# Altium schematic sheet StandUp.SchDoc: Moduł do monitorowania czasu siedzenia
size A4; DrawnBy: MC, JD, AP - zespół 2; DocumentNumber: 1/1; SheetNumber: 1; SheetTotal: 1
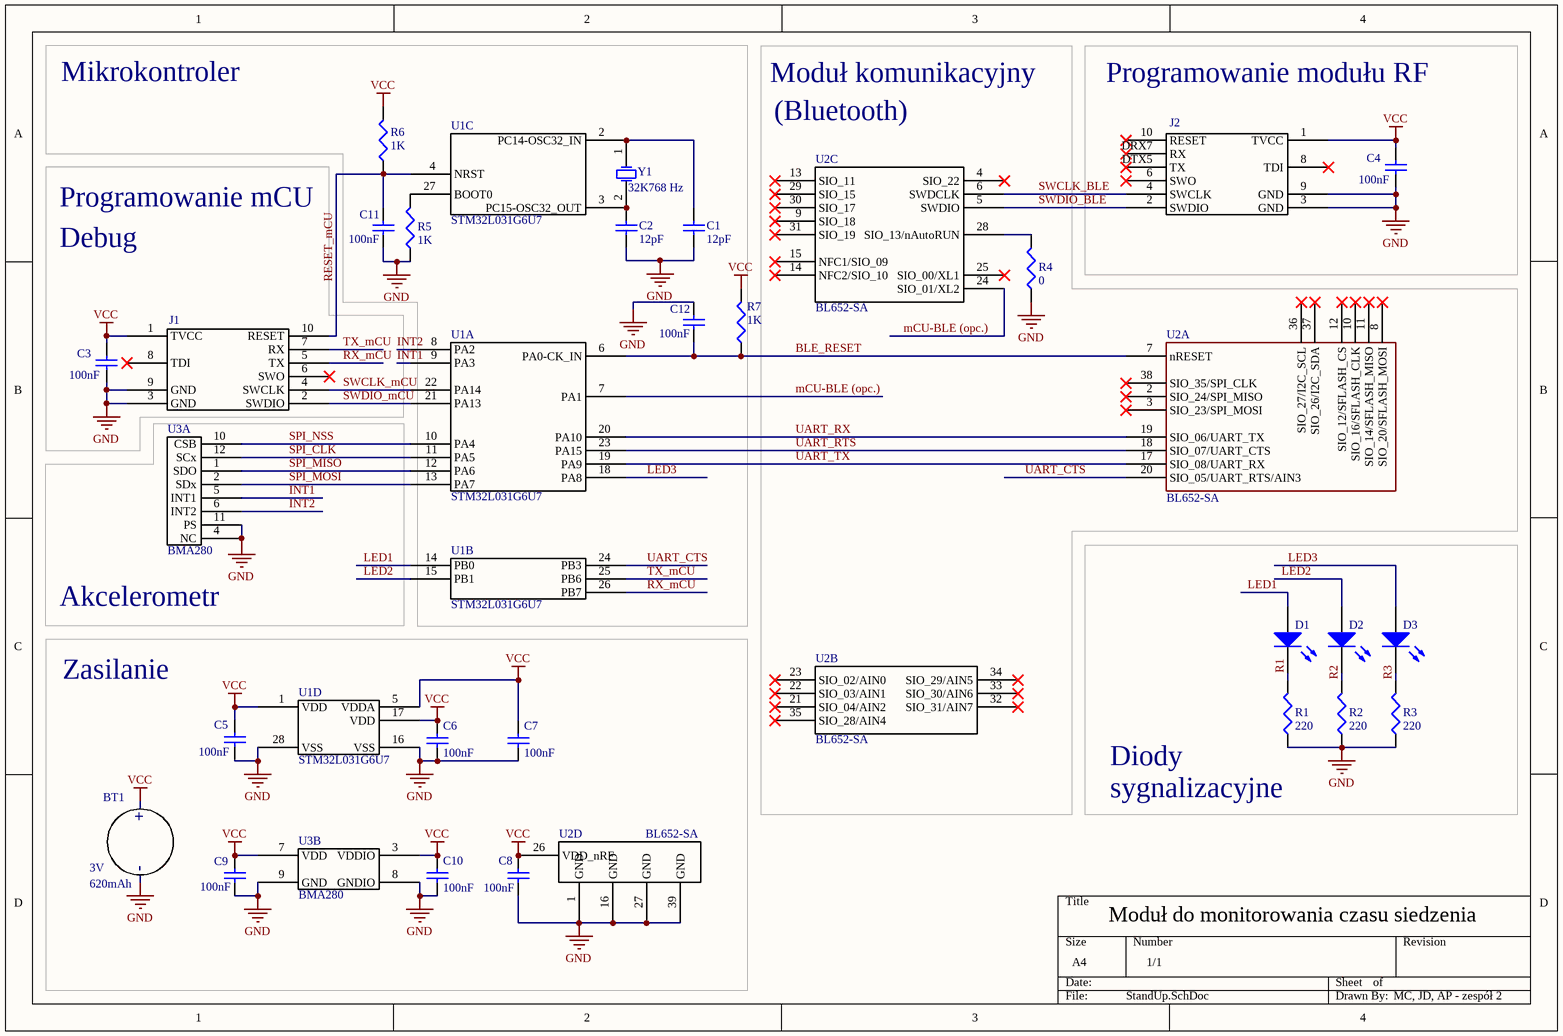
[diagram p0: StandUp.SchDoc]

## Parts
BT1  Voltage: 3V  Capacity: 620mAh  [SMTU2450N_LF]  (hidden comment: SMTU2450N_LF)
C1  value 12pF  [0402]  (hidden comment: Cap Semi)
C2  value 12pF  [0402]  (hidden comment: Cap Semi)
C3  value 100nF  [0402]  (hidden comment: Cap Semi)
C4  value 100nF  [0402]  (hidden comment: Cap Semi)
C5  value 100nF  [0402]
C6  value 100nF  [0402]
C7  value 100nF  [0402]
C8  value 100nF  [0402]
C9  value 100nF  [0402]
C10  value 100nF  [0402]
C11  value 100nF  [0402]  (hidden comment: Cap Semi)
C12  value 100nF  [0402]  (hidden comment: Cap Semi)
D1  LED2  [MC_DIODE]  (value not drawn)
D2  LED2  [MC_DIODE]  (value not drawn)
D3  LED2  [MC_DIODE]  (value not drawn)
J1  Cortez JTAG_UART  [MC_JTAG]  (value not drawn)
J2  Cortez JTAG_UART  [MC_JTAG]  (value not drawn)
R1  value 220  [0402]  (hidden comment: Res3)
R2  value 220  [0402]  (hidden comment: Res3)
R3  value 220  [0402]  (hidden comment: Res3)
R4  value 0  [0402]  (hidden comment: Res3)
R5  value 1K  [0402]  (hidden comment: Res3)
R6  value 1K  [0402]  (hidden comment: Res3)
R7  value 1K  [0402]  (hidden comment: Res3)
U1  STM32L031G6U7  [MC_UFQFPN-28]  (parts A,B,C,D of 4)
U2  BL652-SA  [BL652]  (parts A,B,C,D of 4)
U3  BMA280  [JD_LGA]  (parts A,B of 2)
Y1  Frequency: 32K768 Hz  [MC_XTAL]  (hidden comment: XTAL)

## Blocks framed on the sheet
Mikrokontroler: C1 C2 C11 C12 R5-R7 U1 Y1
Programowanie modułu RF: C4 J2
Akcelerometr: U3
Zasilanie: BT1 C5-C10 U1-U3

## Nets
GND: C1.1 C2.1 C3.2 C4.2 C5.1 C6.1 C7.1 C8.1 C9.1 C10.1 C11.1 C12.2 J1.3(GND) J1.9(GND) J2.3(GND) J2.9(GND) R1.1 R2.1 R3.1 R4.1 R5.1 U1.16(VSS) U1.28(VSS) U2.1(GND) U2.16(GND) U2.27(GND) U2.39(GND) U3.4(NC) U3.8(GNDIO) U3.9(GND) U3.11(PS)
VCC: C3.1 C4.1 C5.2 C6.2 C7.2 C8.2 C9.2 C10.2 J1.1(TVCC) J2.1(TVCC) R6.2 R7.2 U1.1(VDD) U1.5(VDDA) U1.17(VDD) U2.26(VDD_nRF) U3.3(VDDIO) U3.7(VDD)
BLE_RESET: C12.1 R7.1 U1.6(PA0-CK_IN) U2.7(nRESET)
INT1: U1.9(PA3) U3.5(INT1)
INT2: U1.8(PA2) U3.6(INT2)
LED1: D1.1(A) U1.14(PB0)
LED2: D2.1(A) U1.15(PB1)
LED3: D3.1(A) U1.18(PA8)
mCU-BLE (opc.): U1.7(PA1) U2.24(SIO_01/XL2)
R1: D1.2(K) R1.2
R2: D2.2(K) R2.2
R3: D3.2(K) R3.2
RESET_mCU: C11.2 J1.10(RESET) R6.1 U1.4(NRST)
RX_mCU: J1.5(TX) U1.26(PB7)
SPI_CLK: U1.11(PA5) U3.12(SCx)
SPI_MISO: U1.12(PA6) U3.1(SDO)
SPI_MOSI: U1.13(PA7) U3.2(SDx)
SPI_NSS: U1.10(PA4) U3.10(CSB)
SWCLK_BLE: J2.4(SWCLK) U2.6(SWDCLK)
SWCLK_mCU: J1.4(SWCLK) U1.22(PA14)
SWDIO_BLE: J2.2(SWDIO) U2.5(SWDIO)
SWDIO_mCU: J1.2(SWDIO) U1.21(PA13)
TX_mCU: J1.7(RX) U1.25(PB6)
UART_CTS: U1.24(PB3) U2.20(SIO_05/UART_RTS/AIN3)
UART_RTS: U1.23(PA15) U2.18(SIO_07/UART_CTS)
UART_RX: U1.20(PA10) U2.19(SIO_06/UART_TX)
UART_TX: U1.19(PA9) U2.17(SIO_08/UART_RX)
NetC1_2: C1.2 U1.2(PC14-OSC32_IN) Y1.1(OSC1)
NetC2_2: C2.2 U1.3(PC15-OSC32_OUT) Y1.2(OSC2)
NetR4_2: R4.2 U2.28(SIO_13/nAutoRUN)
NetR5_2: R5.2 U1.27(BOOT0)

Not connected (* = marked no-connect by the designer): J1 6(SWO)* 8(TDI)*; J2 6(SWO)* 8(TDI)* 10(RESET)* DRX7(RX)* DTX5(TX)*; U2 2(SIO_24/SPI_MISO)* 3(SIO_23/SPI_MOSI)* 4(SIO_22)* 8(SIO_20/SFLASH_MOSI)* 9(SIO_18)* 10(SIO_16/SFLASH_CLK)* 11(SIO_14/SFLASH_MISO)* 12(SIO_12/SFLASH_CS)* 13(SIO_11)* 14(NFC2/SIO_10)* 15(NFC1/SIO_09)* 21(SIO_04/AIN2)* 22(SIO_03/AIN1)* 23(SIO_02/AIN0)* 25(SIO_00/XL1)* 29(SIO_15)* 30(SIO_17)* 31(SIO_19)* 32(SIO_31/AIN7)* 33(SIO_30/AIN6)* 34(SIO_29/AIN5)* 35(SIO_28/AIN4)* 36(SIO_27/I2C_SCL)* 37(SIO_26/I2C_SDA)* 38(SIO_35/SPI_CLK)*

## Notes on the sheet
- Moduł komunikacyjny
- (near U2) (Bluetooth)
- Programowanie mCU
- Debug
- Diody
- sygnalizacyjne
- (in symbol SMTU2450N_LF) +; -

## Library data of the parts
C1-C12 = Cap Semi: Capacitor (Semiconductor SIM Model); Published: 8-Jun-2000; LatestRevisionDate: 29-May-2009; LatestRevisionNote: IPC-7351 Footprint Added.; PackageReference: C1206; Publisher: Altium Limited; PackageDescription: Chip Capacitor
D1-D3 = LED2: Typical RED, GREEN, YELLOW, AMBER GaAs LED; Published: 8-Jun-2000; LatestRevisionDate: 17-Jul-2002; LatestRevisionNote: Re-released for DXP Platform.; PackageVersion: Feb-2002; PackageReference: 3.2X1.6X1.1; Publisher: Altium Limited; PackageDescription: SM LED; 2 Flat Leads
J1 J2 = MC_JTAG
R1-R7 = Res3: Resistor; Published: 8-Jun-2000; LatestRevisionDate: 29-May-2009; LatestRevisionNote: IPC-7351 Footprint Added.; PackageReference: J1-0603; Publisher: Altium Limited; PackageDescription: Chip Resistor
U1 = MC_STM32L031G6U7
U2 = BL652
U3 = JD_BMA280
Y1 = XTAL: Crystal Oscillator; Published: 8-Jun-2000; LatestRevisionDate: 17-Jul-2002; LatestRevisionNote: Re-released for DXP Platform.; Publisher: Altium Limited; PackageDescription: Crystal, Thru-Hole; 2 Leads; Body 3.1 x 8.2 mm (Dia.xH)